# Altium schematic sheet HIGH_CURR_MOS.SchDoc
size A4; SheetNumber: 5; SheetTotal: 14
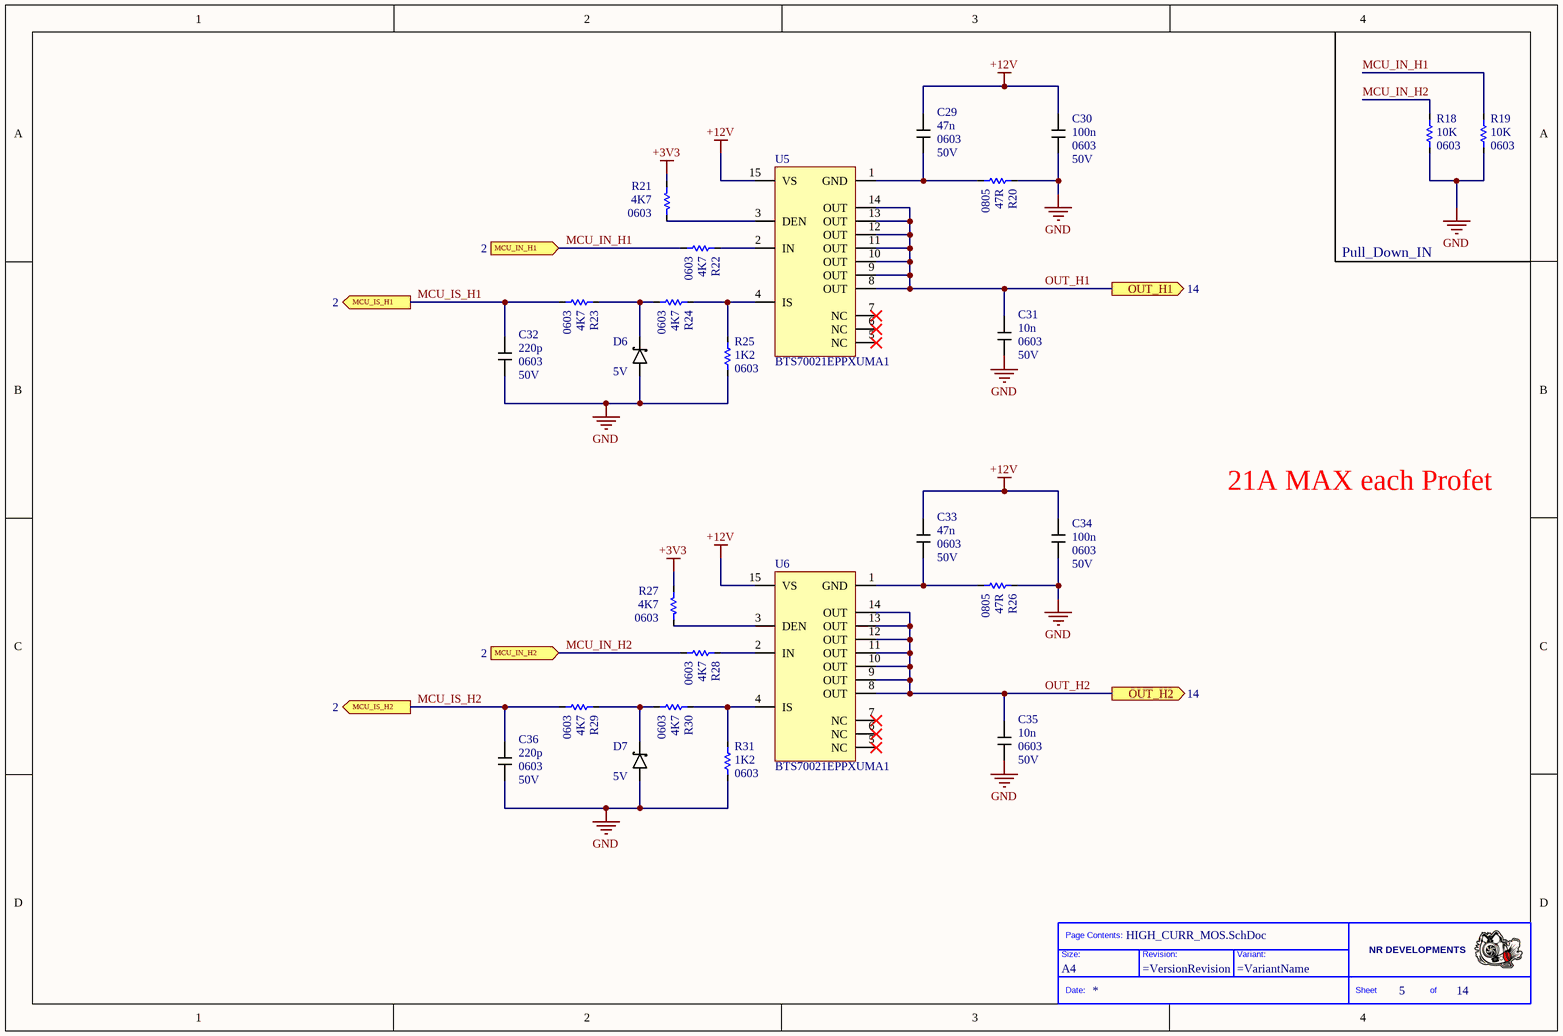
[diagram p0: HIGH_CURR_MOS.SchDoc]

## Parts
*  Size: A4  (hidden comment: Title_Block)  (graphical)
C29  value 47n  Case: 0603  Voltage: 50V  [CAPC1608X09M]  (hidden comment: CAP)
C30  value 100n  Case: 0603  Voltage: 50V  [CAPC1608X09M]  (hidden comment: CAP)
C31  value 10n  Case: 0603  Voltage: 50V  [CAPC1608X09M]  (hidden comment: CAP)
C32  value 220p  Case: 0603  Voltage: 50V  [CAPC1608X09M]  (hidden comment: CAP)
C33  value 47n  Case: 0603  Voltage: 50V  [CAPC1608X09M]  (hidden comment: CAP)
C34  value 100n  Case: 0603  Voltage: 50V  [CAPC1608X09M]  (hidden comment: CAP)
C35  value 10n  Case: 0603  Voltage: 50V  [CAPC1608X09M]  (hidden comment: CAP)
C36  value 220p  Case: 0603  Voltage: 50V  [CAPC1608X09M]  (hidden comment: CAP)
D6  value 5V  [SOT65P210X100-3N - AC]  (hidden comment: Diode_Schottky)
D7  value 5V  [SOT65P210X100-3N - AC]  (hidden comment: Diode_Schottky)
R18  value 10K  Case: 0603  [RESC1608X06M]  (hidden comment: Res)
R19  value 10K  Case: 0603  [RESC1608X06M]  (hidden comment: Res)
R20  value 47R  Case: 0805  [RESC2012X06N]  (hidden comment: Res)
R21  value 4K7  Case: 0603  [RESC1608X06M]  (hidden comment: Res)
R22  value 4K7  Case: 0603  [RESC1608X06M]  (hidden comment: Res)
R23  value 4K7  Case: 0603  [RESC1608X06M]  (hidden comment: Res)
R24  value 4K7  Case: 0603  [RESC1608X06M]  (hidden comment: Res)
R25  value 1K2  Case: 0603  [RESC1608X06M]  (hidden comment: Res)
R26  value 47R  Case: 0805  [RESC2012X06N]  (hidden comment: Res)
R27  value 4K7  Case: 0603  [RESC1608X06M]  (hidden comment: Res)
R28  value 4K7  Case: 0603  [RESC1608X06M]  (hidden comment: Res)
R29  value 4K7  Case: 0603  [RESC1608X06M]  (hidden comment: Res)
R30  value 4K7  Case: 0603  [RESC1608X06M]  (hidden comment: Res)
R31  value 1K2  Case: 0603  [RESC1608X06M]  (hidden comment: Res)
U5  value BTS70021EPPXUMA1  [SOP65P600X115-15]  (hidden comment: BTS7002-1EPP)
U6  value BTS70021EPPXUMA1  [SOP65P600X115-15]  (hidden comment: BTS7002-1EPP)

## Ports
MCU_IN_H1 (in, see 2), MCU_IN_H2 (in, see 2), MCU_IS_H1 (out, see 2), MCU_IS_H2 (out, see 2), OUT_H1 (out, see 14), OUT_H2 (out, see 14)

## Nets
+3V3: R21.2 R27.2
+12V: C29.1 C30.1 C33.1 C34.1 U5.15(VS) U6.15(VS)
GND: C30.2 C31.2 C32.2 C34.2 C35.2 C36.2 D6.A D7.A R18.1 R19.1 R20.2 R25.1 R26.2 R31.1
MCU_IN_H1: R19.2 R22.1 ; port MCU_IN_H1
MCU_IN_H2: R18.2 R28.1 ; port MCU_IN_H2
MCU_IS_H1: C32.1 R23.1 ; port MCU_IS_H1
MCU_IS_H2: C36.1 R29.1 ; port MCU_IS_H2
OUT_H1: C31.1 U5.8(OUT) U5.9(OUT) U5.10(OUT) U5.11(OUT) U5.12(OUT) U5.13(OUT) U5.14(OUT) ; port OUT_H1
OUT_H2: C35.1 U6.8(OUT) U6.9(OUT) U6.10(OUT) U6.11(OUT) U6.12(OUT) U6.13(OUT) U6.14(OUT) ; port OUT_H2
NetC29_2: C29.2 R20.1 U5.1(GND)
NetC33_2: C33.2 R26.1 U6.1(GND)
NetD6_C: D6.C R23.2 R24.1
NetD7_C: D7.C R29.2 R30.1
NetR21_1: R21.1 U5.3(DEN)
NetR22_2: R22.2 U5.2(IN)
NetR24_2: R24.2 R25.2 U5.4(IS)
NetR27_1: R27.1 U6.3(DEN)
NetR28_2: R28.2 U6.2(IN)
NetR30_2: R30.2 R31.2 U6.4(IS)

Not connected (* = marked no-connect by the designer): U5 5(NC)* 6(NC)* 7(NC)*; U6 5(NC)* 6(NC)* 7(NC)*

## Notes on the sheet
- Pull_Down_IN
- 21A MAX each Profet
- (in symbol Title_Block) Page Contents:; NR DEVELOPMENTS; Size:; Revision:; Variant:; Date:; Sheet; of

## Library data of the parts
C29 C33 = CAP: Manufacturer: KEMET; PartNumber: C0603C473M5RACTU
C30 C34 = CAP: Manufacturer: KEMET; PartNumber: C0603C104K5RACTU
C31 C35 = CAP: Manufacturer: KEMET; PartNumber: C0603C103M5RACTM
C32 C36 = CAP: Manufacturer: KEMET; PartNumber: C0603C221J5RACTU
D6 = Diode_Schottky: Manufacturer: NEXPERIA; PartNumber: BZX84W-C4V7-QX; Case: SOT-323-3
D7 = Diode_Schottky: Manufacturer: Nexperia; PartNumber: BZX84W-C4V7-QX; Case: SOT-323-3
R18 R19 = Resistor: Manufacturer: YAGEO; PartNumber: AC0603FR-0710KL
R20 R26 = Resistor: Manufacturer: Vishay; PartNumber: CRCW080547R0FKEA
R21-R24 R27-R30 = Resistor: Manufacturer: YAGEO; PartNumber: RC0603FR-074K7L
R25 R31 = Resistor: Manufacturer: Vishay; PartNumber: CRCW06031K20FKEA
U5 U6 = BTS7002-1EPP: Smart High-Side Power Switch 21A; Manufacturer: Infineon Technologies; PartNumber: BTS70021EPPXUMA1; Case: TSDSO-14